# Altium schematic sheet STM32_Power.SchDoc
size A; SheetNumber: 2; SheetTotal: 4
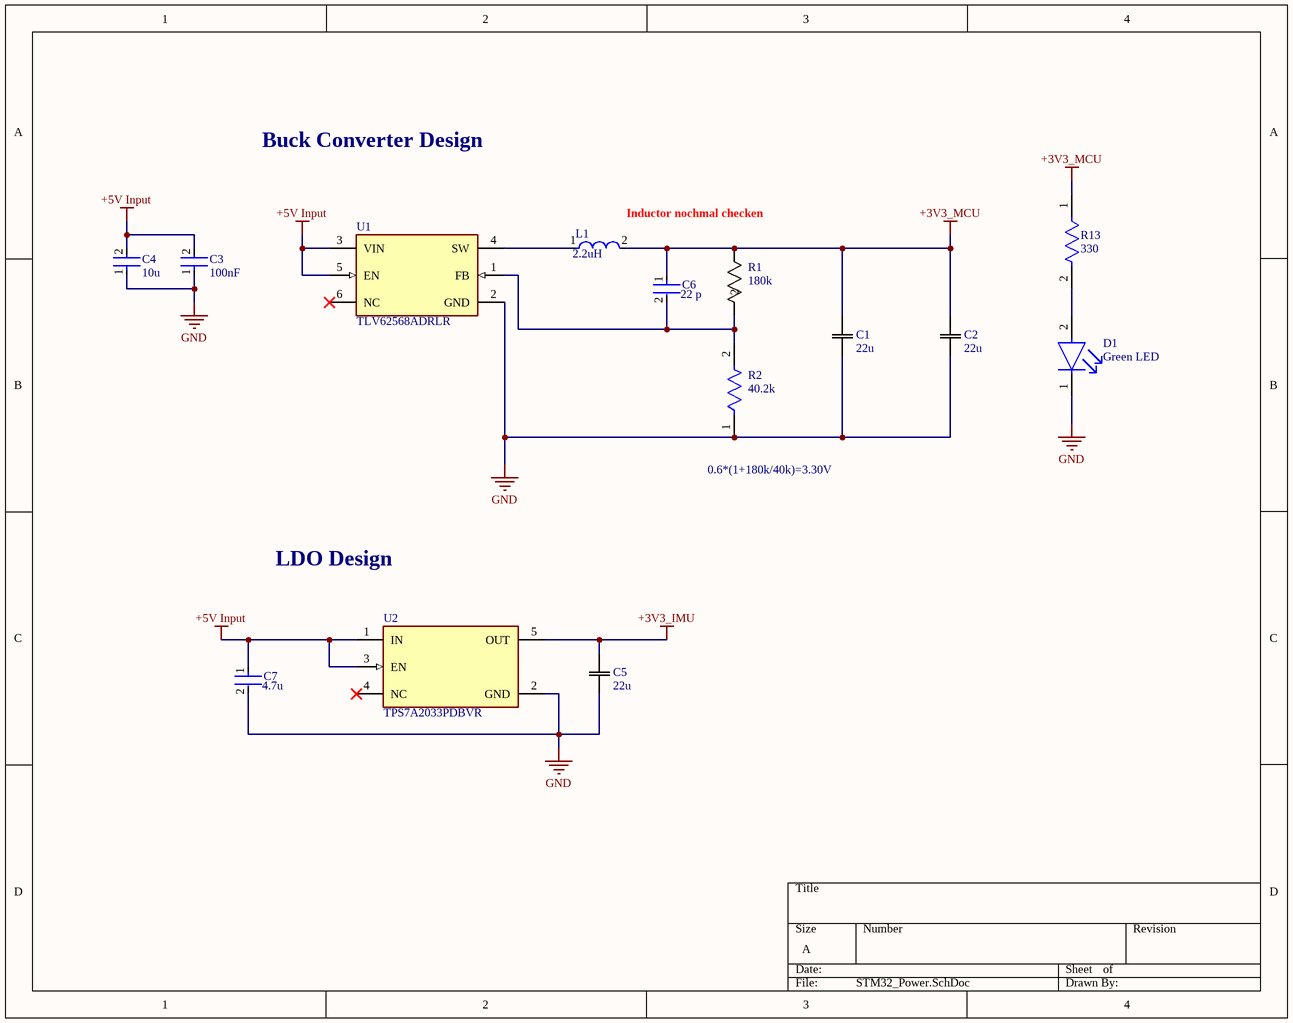
[diagram p0: STM32_Power.SchDoc]

## Parts
C1  value 22u  [CAP_MSAS16-8_TAY]  (hidden comment: MSASL168BB5226MTNA01)
C2  value 22u  [CAP_MSAS16-8_TAY]  (hidden comment: MSASL168BB5226MTNA01)
C3  Capacitance: 100nF  [FP-0603B104K250CT-IPC_C]  (hidden comment: 0603B104K250CT)
C4  value 10u  [FP-GRM188-0_2-IPC_B]  (hidden comment: GRM188Z71A106MA73D)
C5  value 22u  [CAP_MSAS16-8_TAY]  (hidden comment: MSASL168BB5226MTNA01)
C6  value 22 p  [FP-C0603C-CF-MFG]  (hidden comment: C0603C220F5GACAUTO)
C7  Capacitance: 4.7u  [FP-GRM188-0_15-MFG]  (hidden comment: GRM188R61C475KE11J)
D1  Green LED  [FP-LTST-C190KGKT-MFG]
L1  value 2.2uH  [FP-IHLP-1616AB-FP_1_8545x-MFG]  (hidden comment: IHLP1616ABER2R2M11)
R1  value 180k  [RC0603N_YAG]  (hidden comment: RC0603FR-07180KL)
R2  Resistance: 40.2k  [FP-RMCF0603-IPC_A]  (hidden comment: RMCF0603FT40K2)
R13  Resistance: 330  [FP-RT0603-MFG]  (hidden comment: RT0603FRD07330RL)
U1  TLV62568ADRLR  [FP-DRL0006A-MFG]
U2  TPS7A2033PDBVR  [FP-DBV0005A-MFG]

## Nets
+3V3_IMU: C5.2 U2.5(OUT)
+3V3_MCU: C1.2 C2.2 C6.1 L1.2 R1.1 R13.1
+5V Input: C3.2 C4.2 C7.1 U1.3(VIN) U1.5(EN) U2.1(IN) U2.3(EN)
GND: C1.1 C2.1 C3.1 C4.1 C5.1 C7.2 D1.1(C) R2.1 U1.2(GND) U2.2(GND)
NetC6_2: C6.2 R1.2 R2.2 U1.1(FB)
NetD1_2: D1.2(A) R13.2
NetL1_1: L1.1 U1.4(SW)

Not connected (* = marked no-connect by the designer): U1 6(NC)*; U2 4(NC)*

## Notes on the sheet
- Buck Converter Design
- Inductor nochmal checken
- 0.6*(1+180k/40k)=3.30V
- LDO Design

## Library data of the parts
C1 C2 C5 = MSASL168BB5226MTNA01: MSASL168BB5226MTNA01, CAP CER 22UF 10V X5R 0603; Manufacturer_Name: TAIYO YUDEN; Copyright: Copyright (C) 2026 Ultra Librarian. All rights reserved.; Manufacturer_Part_Number: MSASL168BB5226MTNA01
C3 = CMP-45632-000009-1: CAP CER 0.1UF 25V X7R 0603; Tolerance: 10%; Voltage Rating (DC): 25V; Dielectric: X7R; Packaging: Tape and Reel; RoHS Compliant: Yes; Case Code (Imperial): 0603; Depth: 0.8mm; Voltage Rating: 25V; Case Code (Metric): 1608; Lead Free: Lead Free; Min Operating Temperature: -55°C; Max Operating Temperature: 125°C; Length: 1.6mm; Case/Package: Ceramic; Radiation Hardening: No
C4 = CMP-06035-036920-1: Chip Multilayer Ceramic Capacitors for General Purpose, 0603, 10uF, X7R, 15%, 20%, 10V; Case/Package: 0603
C6 = CMP-03020-032046-1: C0603 22 pF C0G 30ppm/°C 1.00% 50 V; Manufacturer: KEMET; Tolerance: 0.01; Material: Ceramic; Automotive Grade: Grade 1; Voltage Rating: 50 V; Capacitance: 22 pF; Lead Free: Yes; Category: Cap; Device Class L3: Ceramic Capacitors; Manufacturer Part Number: C0603C220F5GACAUTO; Temperature Coefficient: 30ppm/°C; ComponentLink2Description: Datasheet; Temperature Characteristic: C0G; Octopart: https://octopart.com/c0603c220f5gacauto-kemet-89441560; RoHS: TRUE; Device Class L2: Capacitors; Temperature Range High: +125°C; Height: 0.87mm; Package: C0603C-CF; Temperature: -55°C to +125°C; ComponentLink2URL: https://api.kemet.com/component-edge/download/datasheet/C0603C100J5GACAUTO.pdf; Device Class L1: Passive Components; Temperature Range Low: -55°C; Automotive: Yes
C7 = CMP-06035-014929-1: Chip Multilayer Ceramic Capacitors for General Purpose, 0603, 4.7uF, X5R, 15%, 10%, 16V; Package Quantity: 10000; Min Operating Temperature: -55°C; Dielectric: X5R; Length: 0.063inch; Tolerance: 10%; Thickness: 0.037inch; Resistor Type: Ceramic; Packaging: Tape and Reel; Case/Package: 0603; Mount: Surface Mount; Height: 0.8mm; Termination: SMD/SMT; Width: 0.031inch; Max Operating Temperature: 85°C; Case Code (Imperial): 0603; Voltage Rating: 16V; Voltage Rating (DC): 16V; Weight: 0.000222oz; Case Code (Metric): 1608
D1 = CMP-2000-05197-2: LED GREEN CLEAR CHIP SMDLTST-C190KGKT; Test Current: 20mA; Power Rating: 75mW; Forward Voltage: 2V; Wavelength: 574nm; Number of LEDs: 1; Reverse Voltage: 5V; Dominant Wavelength: 571nm; Lens Style: Diffused; Luminous Intensity: 35mcd; Forward Current: 30mA; Viewing Angle: 130°; Lens Color: Colorless; Width: 0.8mm; Case Code (Imperial): 0603; Case Code (Metric): 1608; Number of Pins: 2; Radiation Hardening: No; Package Quantity: 1; Lead Free: Lead Free; Lens Transparency: Clear; Depth: 0.8mm; Power Dissipation: 75mW; Mount: Surface Mount; Max Operating Temperature: 85°C; Case/Package: 0603; Height: 0.8mm; Illumination Color: Green; Color: Green; Length: 1.6mm; Packaging: Tape and Reel; Number of Elements: 1; Min Operating Temperature: -55°C
L1 = CMP-02424-000057-1: Fixed Inductors Commercial Low DCR Series SMT 2.2uH 2.75A 83.5mΩ 20%; Max DC Current: 3A; Shielding: Shielded; Test Frequency: 100kHz; Core Material: Metal; DC Resistance (DCR): 83.5mR; Self Resonant Frequency: 49MHz; RMS Current (Irms): 2.75A; Height: 1.2mm; Packaging: Tape and Reel; Military Standard: Not; Radiation Hardening: No; Tolerance: 20%; Inductance Tolerance: 20%; Package Quantity: 1; Saturation Current: 3A; Case Code (Imperial): 1616; Inductance: 2.2uH; Height - Seated (Max): 0.047inch; Min Operating Temperature: -55°C; Contact Plating: Tin; Current Rating: 2.75A; Case/Package: 1616; Max Operating Temperature: 125°C; Mount: Surface Mount; Case Code (Metric): 4040; Termination: SMD/SMT; Lead Free: Lead Free; Length: 4.7mm; Depth: 4.31mm; Width: 0.16inch
R1 = RC0603FR-07180KL: Description; Manufacturer_Name: Yageo; Copyright: Copyright (C) 2025 Ultra Librarian. All rights reserved.; Manufacturer_Part_Number: RC0603FR-07180KL
R2 = CMP-26527-000194-1: 40.2kΩ ±1% 0.1W 0603 Thick Film Chip Resistor AEC-Q200 compliant; Power Rating: 100mW; Temperature Coefficient: 100ppm/°C; Length: 0.061inch; Series: RMCF; Radiation Hardening: No; Min Operating Temperature: -55°C; Case/Package: 0603; Tolerance: 1%; Case Code (Imperial): 0603; Size Code: 0603; Mount: Surface Mount; Height: 0.022inch; Lead Free: Lead Free; Contact Plating: Tin; Resistor Type: Thick Film; Case Code (Metric): 1608; Width: 0.031inch; Packaging: Tape and Reel; RoHS Compliant: Yes; Max Power Dissipation: 100mW; Max Operating Temperature: 155°C; Features: Automotive AEC-Q200; Number of Terminations: 2
R13 = CMP-03412-025644-1: RES SMD 330 OHM 1% 1/10W 0603; Manufacturer: Yageo; Tolerance: 0.01; Power Rating: 0.1W; Temperature Coefficient: 25 ppm/°C; Voltage Rating: 75V; Value: 330Ω; Description: RT0603 330Ω 0.1W 25 ppm/°C 1.00%; Octopart: https://octopart.com/rt0603frd07330rl-yageo-71395358; Temperature: -55°C to +155°C; Height: 0.55mm; Temperature Range Low: -55°C; Category: Res; Manufacturer Part Number: RT0603FRD07330RL; Ipc Land Pattern Name: RESC16080X45; Device Class L1: Passive Components; ComponentLink2Description: Datasheet; Temperature Range High: +155°C; RoHS: TRUE; Footprint Url: http://www.yageo.com/exep/pages/download/literatures/PYu-R_Mount_10.pdf; ComponentLink2URL: http://www.yageo.com/documents/recent/PYu-RT_1-to-0.01_RoHS_L_9.pdf; Automotive: No; Device Class L3: Chip SMD Resistors; Series: RT; Composition: Thin Film; Device Class L2: Resistors; Digikey Description: RES SMD 330 OHM 1% 1/10W 0603; Package: RT0603; Lead Free: Yes
U1 = CMP-04918-000153-1: IC REG BUCK ADJUSTABLE 2A SOT563; Min Output Voltage: 600mV; Max Output Voltage: 5.5V; Synchronous Rectifier: Yes; Min Input Voltage: 2.5V; Number of Outputs: 1; Switching Frequency: 1.5MHz; Output Configuration: Positive; Output Type: Adjustable; Output Current: 2A; Min Operating Temperature: -40°C; Case/Package: SOT-563; Packaging: Tape and Reel; Max Operating Temperature: 125°C; Max Input Voltage: 5.5V; Mount: Surface Mount
U2 = CMP-04917-000300-1: IC REG LINEAR 3.3V 300MA SOT23-5; RoHS Compliant: Yes